# Altium schematic sheet lct_comp.SchDoc: LCT Comparator
size B; Engineer: A. Peck; Organization: UCLA High Energy Physics; DocumentNumber: 2; Revision: 3.0; SheetNumber: 2; SheetTotal: 15; Project: LCT Comparator Tester
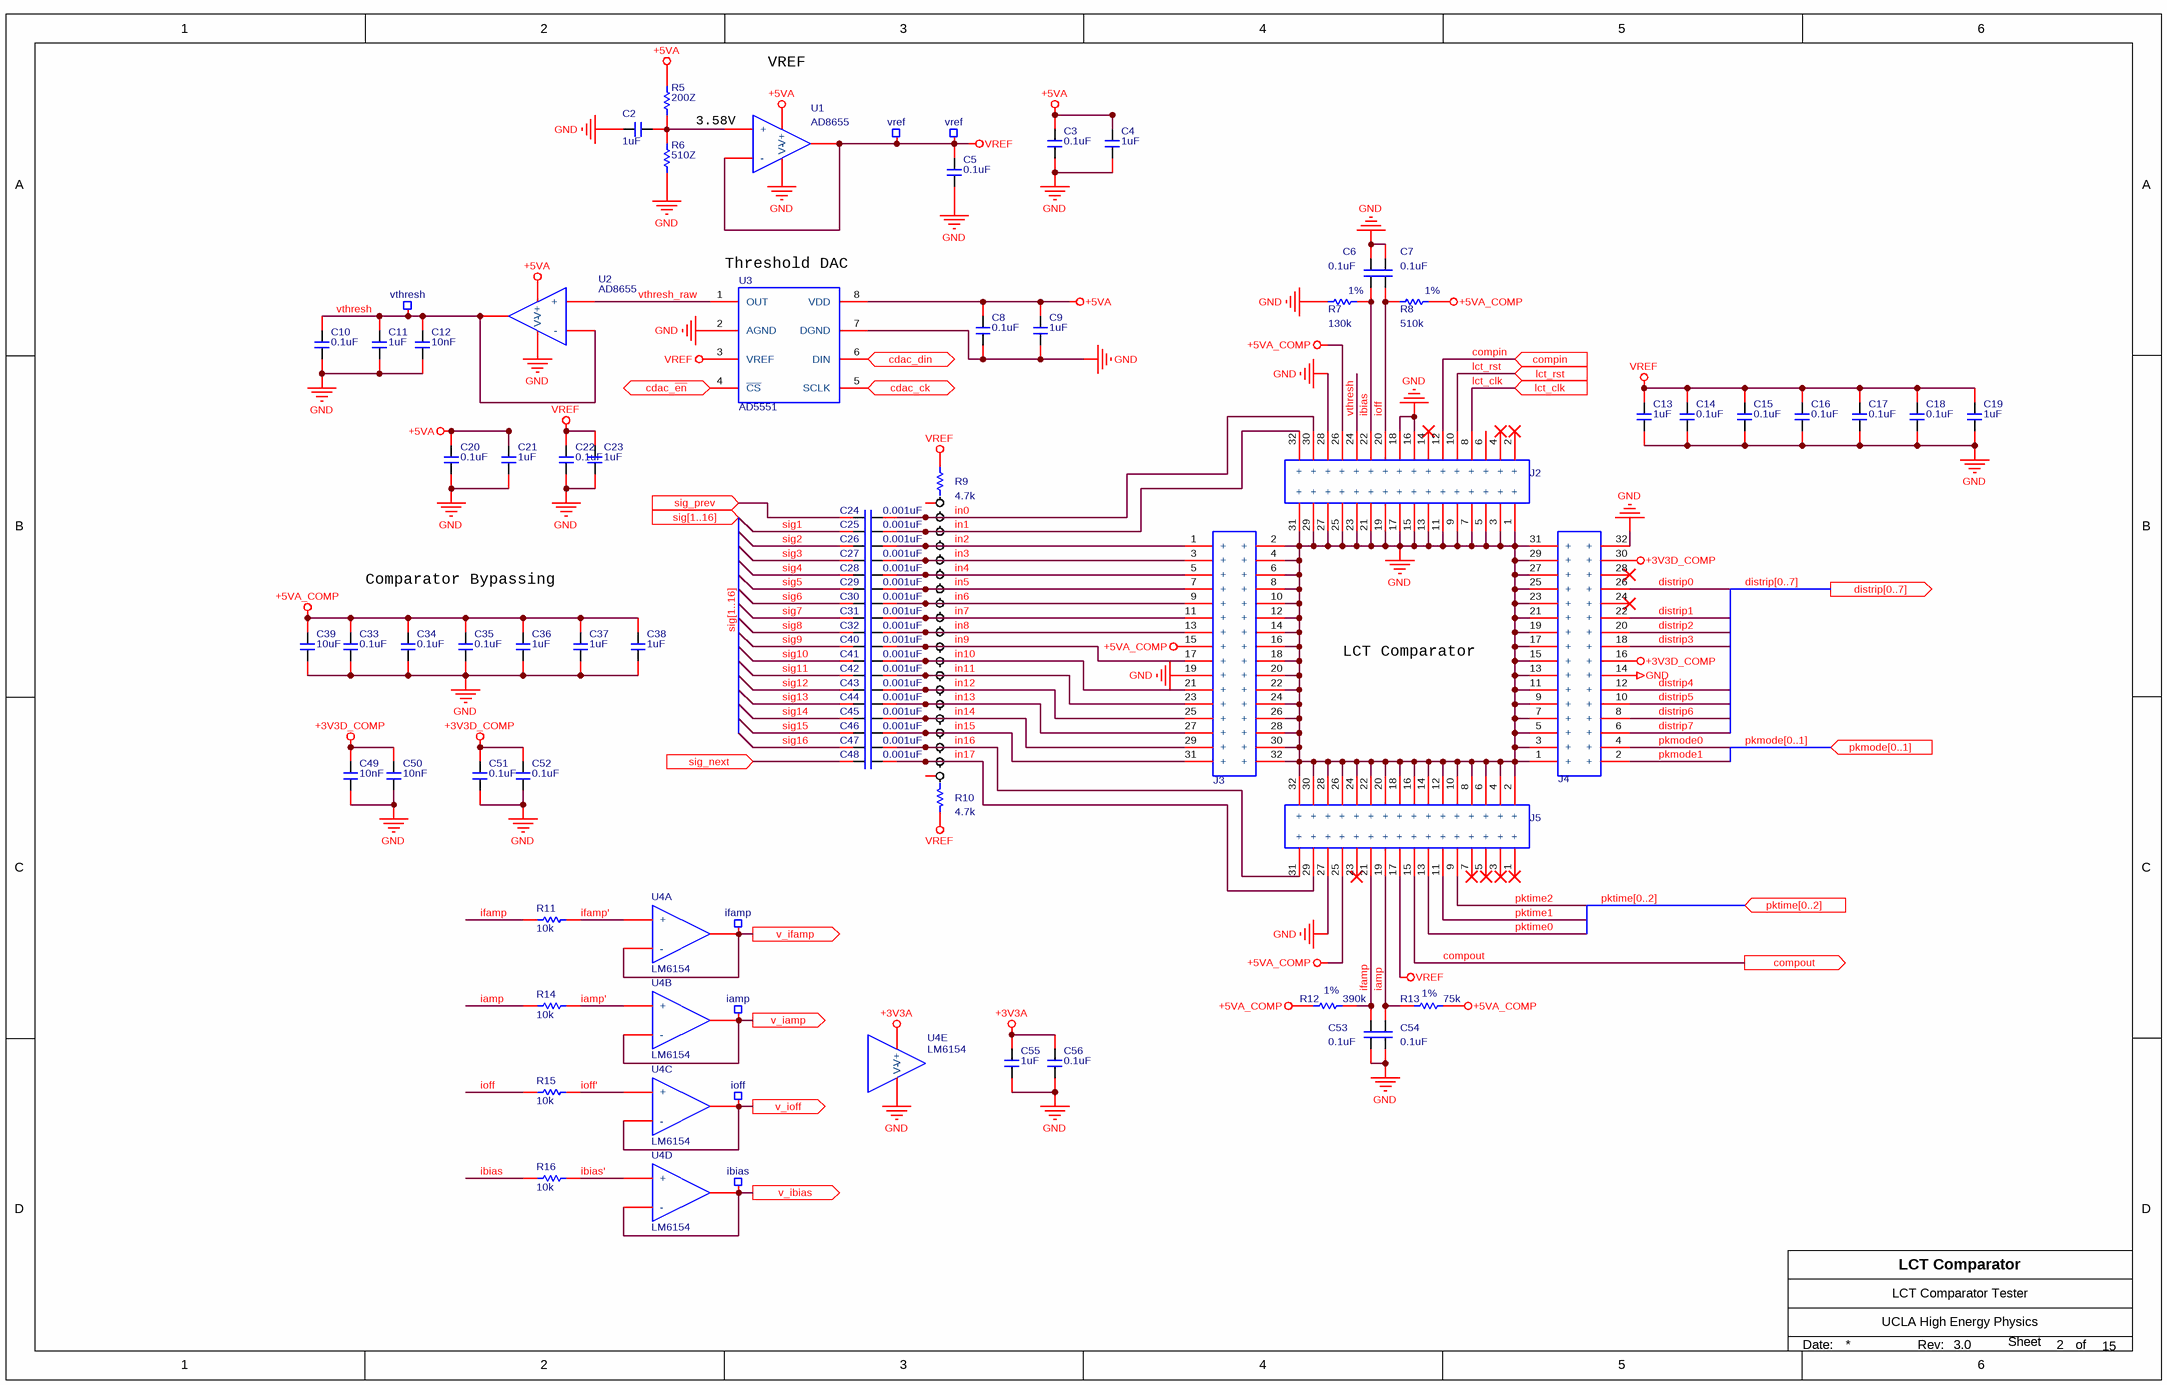
[diagram p0: lct_comp.SchDoc]

## Parts
C2  1uF  [C0603]
C3  0.1uF  [C0603]
C4  1uF  [C0603]
C5  0.1uF  [C0603]
C6  0.1uF  [C0603]
C7  0.1uF  [C0603]
C8  0.1uF  [C0603]
C9  1uF  [C0603]
C10  0.1uF  [C0603]
C11  1uF  [C0603]
C12  10nF  [C0603]
C13  1uF  [C0603]
C14  0.1uF  [C0603]
C15  0.1uF  [C0603]
C16  0.1uF  [C0603]
C17  0.1uF  [C0603]
C18  0.1uF  [C0603]
C19  1uF  [C0603]
C20  0.1uF  [C0603]
C21  1uF  [C0603]
C22  0.1uF  [C0603]
C23  1uF  [C0603]
C24  0.001uF  [C0603]
C25  0.001uF  [C0603]
C26  0.001uF  [C0603]
C27  0.001uF  [C0603]
C28  0.001uF  [C0603]
C29  0.001uF  [C0603]
C30  0.001uF  [C0603]
C31  0.001uF  [C0603]
C32  0.001uF  [C0603]
C33  0.1uF  [C0603]
C34  0.1uF  [C0603]
C35  0.1uF  [C0603]
C36  1uF  [C0603]
C37  1uF  [C0603]
C38  1uF  [C0603]
C39  10uF  [c1206]
C40  0.001uF  [C0603]
C41  0.001uF  [C0603]
C42  0.001uF  [C0603]
C43  0.001uF  [C0603]
C44  0.001uF  [C0603]
C45  0.001uF  [C0603]
C46  0.001uF  [C0603]
C47  0.001uF  [C0603]
C48  0.001uF  [C0603]
C49  10nF  [C0603]
C50  10nF  [C0603]
C51  0.1uF  [C0603]
C52  0.1uF  [C0603]
C53  0.1uF  [C0603]
C54  0.1uF  [C0603]
C55  1uF  [C0603]
C56  0.1uF  [C0603]
J2  HEADER 02x16 RCPT  [HEADER 02x16]  (value not drawn)
J3  HEADER 02x16 RCPT  [HEADER 02x16]  (value not drawn)
J4  HEADER 02x16 RCPT  [HEADER 02x16]  (value not drawn)
J5  HEADER 02x16 RCPT  [HEADER 02x16]  (value not drawn)
R5  200Z  [R0805]
R6  510Z  [R0805]
R7  130k  [R0603]
R8  510k  [R0603]
R9  4.7k  [SIP-11]
R10  4.7k  [SIP-11]
R11  10k  [R0603]
R12  390k  [R0603]
R13  75k  [R0603]
R14  10k  [R0603]
R15  10k  [R0603]
R16  10k  [R0603]
TP1  vref  [TP_MICRO]  (no BOM)
TP2  vref  [TP_MICRO]  (no BOM)
TP3  vthresh  [TP_MICRO]  (no BOM)
TP4  ifamp  [TP_MICRO]  (no BOM)
TP5  iamp  [TP_MICRO]  (no BOM)
TP6  ioff  [TP_MICRO]  (no BOM)
TP7  ibias  [TP_MICRO]  (no BOM)
U1  AD8655  [MSOP-8]
U2  AD8655  [MSOP-8]
U3  AD5551  [SOIC-8]
U4  LM6154  [SOIC-14]  (parts A,B,C,D,E of 5)

## Ports
cdac_ck (in), cdac_din (in), cdac_~{en} (in), compin (in), compout (out), distrip[0..7] (out), lct_clk (in), lct_rst (in), pkmode[0..1] (in), pktime[0..2] (in), sig[1..16] (in), sig_next (in), sig_prev (in), v_iamp (out), v_ibias (out), v_ifamp (out), v_ioff (out)

## Nets
+3V3A: C55.2 C56.2 U4.4(V+)
+3V3D_COMP: C49.2 C50.2 C51.2 C52.2 J4.16(+) J4.30(+)
+5VA: C3.1 C4.2 C8.1 C9.2 C20.1 C21.2 R5.1 U1.7(V+) U2.7(V+) U3.8(VDD)
+5VA_COMP: C33.2 C34.2 C35.2 C36.2 C37.2 C38.2 C39.1 J2.26(+) J3.15(+) J5.25(+) R8.2 R12.1 R13.2
GND: C2.2 C3.2 C4.1 C5.2 C6.2 C7.2 C8.2 C9.1 C10.1 C11.2 C12.1 C13.2 C14.1 C15.1 C16.1 C17.1 C18.1 C19.2 C20.2 C21.1 C22.2 C23.1 C33.1 C34.1 C35.1 C36.1 C37.1 C38.1 C39.2 C49.1 C50.1 C51.1 C52.1 C53.1 C54.1 C55.1 C56.1 J2.1(+) J2.3(+) J2.5(+) J2.7(+) J2.9(+) J2.11(+) J2.13(+) J2.15(+) J2.16(+) J2.17(+) J2.18(+) J2.19(+) J2.21(+) J2.23(+) J2.25(+) J2.27(+) J2.28(+) J2.29(+) J2.31(+) J3.2(+) J3.4(+) J3.6(+) J3.8(+) J3.10(+) J3.12(+) J3.14(+) J3.16(+) J3.18(+) J3.19(+) J3.20(+) J3.22(+) J3.24(+) J3.26(+) J3.28(+) J3.30(+) J3.32(+) J4.1(+) J4.3(+) J4.5(+) J4.7(+) J4.9(+) J4.11(+) J4.13(+) J4.14(+) J4.15(+) J4.17(+) J4.19(+) J4.21(+) J4.23(+) J4.25(+) J4.27(+) J4.29(+) J4.31(+) J4.32(+) J5.2(+) J5.4(+) J5.6(+) J5.8(+) J5.10(+) J5.12(+) J5.14(+) J5.16(+) J5.18(+) J5.20(+) J5.22(+) J5.24(+) J5.26(+) J5.27(+) J5.28(+) J5.30(+) J5.32(+) R6.1 R7.1 U1.4(V-) U2.4(V-) U3.2(AGND) U3.7(DGND) U4.11(V-)
VREF: C5.1 C13.1 C14.2 C15.2 C16.2 C17.2 C18.2 C19.1 C22.1 C23.2 J5.17(+) R9.1 R10.1 TP1.1 TP2.1 U1.2(-) U1.6(OUT) U3.3(VREF)
cdac_ck: U3.5(SCLK) ; port cdac_ck
cdac_din: U3.6(DIN) ; port cdac_din
cdac_~{en}: U3.4(~{CS}) ; port cdac_~{en}
compin: J2.12(+) ; port compin
compout: J5.15(+) ; port compout
distrip0: J4.26(+)
distrip1: J4.22(+)
distrip2: J4.20(+)
distrip3: J4.18(+)
distrip4: J4.12(+)
distrip5: J4.10(+)
distrip6: J4.8(+)
distrip7: J4.6(+)
iamp: C54.2 J5.19(+) R13.1 R14.1
iamp': R14.2 U4.5(+)
ibias: C6.1 J2.22(+) R7.2 R16.1
ibias': R16.2 U4.12(+)
ifamp: C53.2 J5.21(+) R11.1 R12.2
ifamp': R11.2 U4.3(+)
in0: C24.2 J2.30(+) R10.3
in1: C25.2 J2.32(+) R10.4
in2: C26.2 J3.1(+) R10.5
in3: C27.2 J3.3(+) R10.6
in4: C28.2 J3.5(+) R10.7
in5: C29.2 J3.7(+) R10.8
in6: C30.2 J3.9(+) R10.9
in7: C31.2 J3.11(+) R10.10
in8: C32.2 J3.13(+) R10.11
in9: C40.2 J3.17(+) R9.11
in10: C41.2 J3.21(+) R9.10
in11: C42.2 J3.23(+) R9.9
in12: C43.2 J3.25(+) R9.8
in13: C44.2 J3.27(+) R9.7
in14: C45.2 J3.29(+) R9.6
in15: C46.2 J3.31(+) R9.5
in16: C47.2 J5.31(+) R9.4
in17: C48.2 J5.29(+) R9.3
ioff: C7.1 J2.20(+) R8.1 R15.1
ioff': R15.2 U4.10(+)
lct_clk: J2.8(+) ; port lct_clk
lct_rst: J2.10(+) ; port lct_rst
pkmode0: J4.4(+)
pkmode1: J4.2(+)
pktime0: J5.13(+)
pktime1: J5.11(+)
pktime2: J5.9(+)
sig1: C25.1 ; port sig[1..16]
sig2: C26.1
sig3: C27.1
sig4: C28.1
sig5: C29.1
sig6: C30.1
sig7: C31.1
sig8: C32.1
sig9: C40.1  [also labelled sig[1..16]]
sig10: C41.1
sig11: C42.1
sig12: C43.1
sig13: C44.1
sig14: C45.1
sig15: C46.1
sig16: C47.1
sig_next: C48.1 ; port sig_next
sig_prev: C24.1 ; port sig_prev
v_iamp: TP5.1 U4.6(-) U4.7(OUT) ; port v_iamp
v_ibias: TP7.1 U4.13(-) U4.14(OUT) ; port v_ibias
v_ifamp: TP4.1 U4.1(OUT) U4.2(-) ; port v_ifamp
v_ioff: TP6.1 U4.8(OUT) U4.9(-) ; port v_ioff
vthresh: C10.2 C11.1 C12.2 J2.24(+) TP3.1 U2.2(-) U2.6(OUT)
vthresh_raw: U2.3(+) U3.1(OUT)
NetC2_1: C2.1 R5.2 R6.2 U1.3(+)

Not connected (* = marked no-connect by the designer): J2 2(+)* 4(+)* 6(+) 14(+)*; J4 24(+)* 28(+)*; J5 1(+)* 3(+)* 5(+)* 7(+)* 23(+)*; R9 2; R10 2; U1 5(NC) NC(8); U2 5(NC) NC(8)

## Buses and harness runs
bus distrip[0..7] = port distrip[0..7]
bus pkmode[0..1] = port pkmode[0..1]
bus pktime[0..2] = port pktime[0..2]

## Notes on the sheet
- VREF
- 3.58V
- (near U3) Threshold DAC
- (near R7) 1%
- (near R8) 1%
- Comparator Bypassing
- LCT Comparator
- (near R12) 1%
- (near R13) 1%
- Date:
- Rev:
- of
- Sheet

## Library data of the parts
C2 C4 C9 C11 C13 C19 C21 C23 C36-C38 C55 = Murata/GRM188R61E105KA12D: CAP-CER, 2, 1.0uF, 10%, 25V, 0603; Manufacturer: Murata Electronics North America; Capacitance: 1µF; Temperature Coefficient: X5R; Supplier 1: Digi-Key; Supplier Part Number 1: 490-3897-1-ND; Manufacturer Part Number: GRM188R61E105KA12D; RoHS: RoHS Compliant; Category: Capacitors; Stock 1: 1899119; Pricing 1: 1=0.1, 10=0.036, 50=0.0196, 100=0.0165, 250=0.01352, 500=0.01156, 1000=0.009 (USD); Packaging: Cut Tape (CT); Tolerance: ±10%; Voltage - Rated: 25V; Mounting Type: Surface Mount, MLCC; Operating Temperature: -55°C ~ 85°C; Applications: General Purpose; Ratings: -; Package / Case: 0603 (1608 Metric); Size / Dimension: 0.063" L x 0.031" W (1.60mm x 0.80mm); Height - Seated (Max): -; Thickness (Max): 0.035" (0.90mm); Lead Spacing: -; Features: -; Lead Style: -; ComponentLink1URL: http://www.murata.com/~/media/webrenewal/support/library/catalog/products/capacitor/mlcc/c02e.pdf; ComponentLink1Description: http://www.murata.com/~/media/webrenewal/support/library/catalog/products/capacitor/mlcc/c02e.pdf
C3 C5-C8 C10 C14-C18 C20 C22 C33-C35 C51-C54 C56 = CAP/06035C104KAT2A: CAP-CER, 2, 0.1uF, 10%, 50V, 0603, X7R; Manufacturer: AVX Corporation; Capacitance: 0.10µF; Supplier 1: Digi-Key; Manufacturer Part Number: 06035C104KAT2A; RoHS: RoHS Compliant; Category: Capacitors; Stock 1: 4412408; Pricing 1: 1=0.1, 10=0.036, 25=0.0264, 50=0.0198, 100=0.0162, 250=0.01352, 500=0.01156, 1000=0.00908 (USD); Packaging: Cut Tape (CT); Tolerance: ±10%; Voltage - Rated: 50V; Temperature Coefficient: X7R; Mounting Type: Surface Mount, MLCC; Operating Temperature: -55°C ~ 125°C; Applications: General Purpose; Ratings: -; Package / Case: 0603 (1608 Metric); Size / Dimension: 0.063" L x 0.032" W (1.60mm x 0.81mm); Height - Seated (Max): -; Thickness (Max): 0.035" (0.90mm); Lead Spacing: -; Features: -; Lead Style: -; ComponentLink1URL: http://datasheets.avx.com/X7RDielectric.pdf; ComponentLink1Description: http://datasheets.avx.com/X7RDielectric.pdf; Supplier Part Number 1: 478-5052-1-ND; Supplier 2: Newark; Supplier Part Number 2: 54K2412
C12 C49 C50 = CAP/GRM188R71H103KA01D: CAP-CER, 2, 0.01uF, 10%, 50V, X7R, 0603; Manufacturer: Murata Electronics North America; Capacitance: 10000pF; Supplier 1: Digi-Key; Supplier Part Number 1: 490-1512-1-ND; Manufacturer Part Number: GRM188R71H103KA01D; RoHS: RoHS Compliant; Category: Capacitors; Stock 1: 3035311; Pricing 1: 1=0.1, 10=0.019, 50=0.01, 100=0.0085, 250=0.00696, 500=0.00596, 1000=0.00465 (USD); Packaging: Cut Tape (CT); Tolerance: ±10%; Voltage - Rated: 50V; Temperature Coefficient: X7R; Mounting Type: Surface Mount, MLCC; Operating Temperature: -55°C ~ 125°C; Applications: General Purpose; Ratings: -; Package / Case: 0603 (1608 Metric); Size / Dimension: 0.063" L x 0.031" W (1.60mm x 0.80mm); Height - Seated (Max): -; Thickness (Max): 0.035" (0.90mm); Lead Spacing: -; Features: -; Lead Style: -; ComponentLink1URL: http://www.murata.com/~/media/webrenewal/support/library/catalog/products/capacitor/mlcc/c02e.pdf; ComponentLink1Description: http://www.murata.com/~/media/webrenewal/support/library/catalog/products/capacitor/mlcc/c02e.pdf; Supplier 2: Newark; Supplier Part Number 2: 38K1669
C24-C32 C40-C48 = CAP/GRM188R71H102KA01D: CAP-CER, 0, 1000pF, 10%, 50V, 0603; Manufacturer: Murata Electronics North America; Temperature Coefficient: X7R; Supplier 1: Digi-Key; Supplier Part Number 1: 490-1494-6-ND; Manufacturer Part Number: GRM188R71H102KA01D; RoHS: RoHS Compliant; Category: Capacitors; Stock 1: 1044569; Pricing 1: 1=0.1, 10=0.02, 50=0.0108, 100=0.0091, 250=0.00744, 500=0.00636, 1000=0.00495 (USD); Packaging: Digi-Reel®; Capacitance: 1000pF; Tolerance: ±10%; Voltage - Rated: 50V; Mounting Type: Surface Mount, MLCC; Operating Temperature: -55°C ~ 125°C; Applications: General Purpose; Ratings: -; Package / Case: 0603 (1608 Metric); Size / Dimension: 0.063" L x 0.031" W (1.60mm x 0.80mm); Height - Seated (Max): -; Thickness (Max): 0.035" (0.90mm); Lead Spacing: -; Features: -; Lead Style: -; ComponentLink1URL: http://www.murata.com/~/media/webrenewal/support/library/catalog/products/capacitor/mlcc/c02e.pdf; ComponentLink1Description: http://www.murata.com/~/media/webrenewal/support/library/catalog/products/capacitor/mlcc/c02e.pdf; Supplier 2: Newark; Supplier Part Number 2: 51B220
C39 = CAP/GMK316F106ZL-T: CAP-CER, 2, 10uF, 10%, 35V, 1206; Manufacturer: Taiyo Yuden; Capacitance: 10µF; Tolerance: -20%, +80%; Temperature Coefficient: Y5V (F); Supplier 1: Digi-Key; Manufacturer Part Number: GMK316F106ZL-T; RoHS: RoHS Compliant; Category: Capacitors; Packaging: Cut Tape (CT); Voltage - Rated: 35V; Mounting Type: Surface Mount, MLCC; Operating Temperature: -30°C ~ 85°C; Package / Case: 1206 (3216 Metric); Size / Dimension: 0.126" L x 0.063" W (3.20mm x 1.60mm); Height - Seated (Max): -; Lead Spacing: -; Features: -; ComponentLink1URL: http://ds.yuden.co.jp/TYCOMPAS/ut/detail.do?productNo=GMK316F106ZL-T&fileName=GMK316F106ZL-T_SS&mode=specSheetDownload; ComponentLink1Description: http://ds.yuden.co.jp/TYCOMPAS/ut/detail.do?productNo=GMK316F106ZL-T&fileName=GMK316F106ZL-T_SS&mode=specSheetDownload; Supplier Part Number 1: 587-1352-1-ND; Stock 1: 249989; Pricing 1: 1=0.46, 10=0.345, 50=0.2012, 100=0.161, 250=0.115, 500=0.0782, 1000=0.06325 (USD); Applications: General Purpose; Ratings: -; Thickness (Max): 0.071" (1.80mm); Lead Style: -
J2-J5 = HEADER 02x16 RCPT: Header, 02x16, 100 mil, PTH; Manufacturer: TE Connectivity AMP Connectors; Manufacturer Part Number: 6-534206-6; Connector Type: Receptacle; Number of Positions: 32; Number of Positions Loaded: All; Pitch: 0.100" (2.54mm); Supplier 1: Digi-Key; RoHS: RoHS Compliant; Category: Connectors, Interconnects; Stock 1: 447; Pricing 1: 1=4.43, 10=4.255, 50=3.7234, 100=3.546, 250=3.10276, 500=3.0141, 1000=2.57085, 2500=2.561 (USD); Packaging: Tube; Part Status: Active; Contact Type: Female Socket; Number of Rows: 2; Row Spacing: 0.100" (2.54mm); Mounting Type: Through Hole; Termination: Solder; Fastening Type: -; Features: -; Contact Finish: Gold; Contact Finish Thickness: 30µin (0.76µm); Color: Black; ComponentLink1URL: http://www.te.com/commerce/DocumentDelivery/DDEController?Action=srchrtrv&DocNm=534206&DocType=Customer+Drawing&DocLang=English; ComponentLink1Description: http://www.te.com/commerce/DocumentDelivery/DDEController?Action=srchrtrv&DocNm=534206&DocType=Customer+Drawing&DocLang=English; Supplier Part Number 1: A32946-ND
R5 = CRCW0805200RFKEA: RES0, SMD,  200Z, 1.0%, 1/10W, 0805; Manufacturer: Vishay Dale; Resistance (Ohms): 200; Tolerance: ±1%; Power (Watts): 0.125W, 1/8W; Temperature Coefficient: ±100ppm/°C; Supplier 1: Digi-Key; Manufacturer Part Number: CRCW0805200RFKEA; RoHS: RoHS Compliant; Category: Resistors; Stock 1: 204736; Pricing 1: 1=0.1, 10=0.04, 25=0.0288, 50=0.022, 100=0.0162, 250=0.01236, 500=0.0099, 1000=0.00729, 2500=0.00632 (USD); Packaging: Cut Tape (CT); Part Status: Active; Composition: Thick Film; Features: Automotive AEC-Q200; Operating Temperature: -55°C ~ 155°C; Package / Case: 0805 (2012 Metric); Supplier Device Package: 0805; Size / Dimension: 0.079" L x 0.049" W (2.00mm x 1.25mm); Height - Seated (Max): 0.020" (0.50mm); Number of Terminations: 2; Failure Rate: -; ComponentLink1URL: http://www.vishay.com/docs/20035/dcrcwe3.pdf; ComponentLink1Description: http://www.vishay.com/docs/20035/dcrcwe3.pdf; Supplier Part Number 1: 541-200CCT-ND
R6 = CRCW0805510RFKEA: RES0, SMD,  510Z, 1.0%, 1/10W, 0805; Manufacturer: Vishay Dale; Resistance (Ohms): 510; Tolerance: ±1%; Power (Watts): 0.125W, 1/8W; Temperature Coefficient: ±100ppm/°C; Supplier 1: Digi-Key; Manufacturer Part Number: CRCW0805510RFKEA; RoHS: RoHS Compliant; Category: Resistors; Stock 1: 33353; Pricing 1: 1=0.1, 10=0.04, 25=0.0288, 50=0.022, 100=0.0162, 250=0.01236, 500=0.0099, 1000=0.00729, 2500=0.00632 (USD); Packaging: Cut Tape (CT); Part Status: Active; Composition: Thick Film; Features: Automotive AEC-Q200; Operating Temperature: -55°C ~ 155°C; Package / Case: 0805 (2012 Metric); Supplier Device Package: 0805; Size / Dimension: 0.079" L x 0.049" W (2.00mm x 1.25mm); Height - Seated (Max): 0.020" (0.50mm); Number of Terminations: 2; Failure Rate: -; ComponentLink1URL: http://www.vishay.com/docs/20035/dcrcwe3.pdf; ComponentLink1Description: http://www.vishay.com/docs/20035/dcrcwe3.pdf; Supplier Part Number 1: 541-510CCT-ND
R7 = CRCW0603130KFKEA: RES1, SMD,  130k, 1.0%, 1/10W, 0603; Manufacturer: Vishay Dale; Tolerance: ±1%; Power (Watts): 0.1W, 1/10W; Temperature Coefficient: ±100ppm/°C; Supplier 1: Digi-Key; Manufacturer Part Number: CRCW0603130KFKEA; RoHS: RoHS Compliant; Category: Resistors; Stock 1: 32167; Pricing 1: 1=0.1, 10=0.03, 25=0.022, 50=0.0168, 100=0.0123, 250=0.0094, 500=0.00752, 1000=0.00554, 2500=0.00481 (USD); Packaging: Cut Tape (CT); Part Status: Active; Resistance (Ohms): 130k; Composition: Thick Film; Features: Automotive AEC-Q200; Operating Temperature: -55°C ~ 155°C; Package / Case: 0603 (1608 Metric); Supplier Device Package: 0603; Size / Dimension: 0.063" L x 0.033" W (1.60mm x 0.85mm); Height - Seated (Max): 0.020" (0.50mm); Number of Terminations: 2; Failure Rate: -; ComponentLink1URL: http://www.vishay.com/docs/20035/dcrcwe3.pdf; ComponentLink1Description: http://www.vishay.com/docs/20035/dcrcwe3.pdf; Supplier Part Number 1: 541-130KHCT-ND
R8 = RES/RC0603JR-07510KL: RES1, SMD,  510k, 1.0%, 1/10W, 0603; Manufacturer: Yageo; Tolerance: ±5%; Power (Watts): 0.1W, 1/10W; Temperature Coefficient: ±100ppm/°C; Supplier 1: Digi-Key; Manufacturer Part Number: RC0603JR-07510KL; RoHS: RoHS Compliant; Category: Resistors; Stock 1: 110895; Pricing 1: 1=0.1, 10=0.011, 25=0.008, 100=0.0044, 250=0.00336, 500=0.0027, 1000=0.00198, 2500=0.00172 (USD); Packaging: Cut Tape (CT); Resistance (Ohms): 510k; Composition: Thick Film; Features: Moisture Resistant; Operating Temperature: -55°C ~ 155°C; Package / Case: 0603 (1608 Metric); Supplier Device Package: 0603; Size / Dimension: 0.063" L x 0.031" W (1.60mm x 0.80mm); Height: 0.022" (0.55mm); Number of Terminations: 2; ComponentLink1URL: http://www.yageo.com/documents/recent/PYu-RC_Group_51_RoHS_L_04.pdf; ComponentLink1Description: http://www.yageo.com/documents/recent/PYu-RC_Group_51_RoHS_L_04.pdf; Supplier Part Number 1: 311-510KGRCT-ND
R9 R10 = R4K7_SIP10: 4611X-101-472LF; Manufacturer: Bourns Inc.; Circuit Type: Bussed; Tolerance: ±2%; Number of Resistors: 10; Power Per Element: 200mW; Temperature Coefficient: ±100ppm/°C; Manufacturer Part Number: 4611X-101-472LF; RoHS: RoHS Compliant; Category: Resistors; Packaging: Bulk; Resistance (Ohms): 4.7k; Number of Pins: 11; Operating Temperature: -55°C ~ 125°C; Applications: -; Mounting Type: Through Hole; Package / Case: 11-SIP; Supplier Device Package: 11-SIP; Size / Dimension: 1.098" L x 0.098" W (27.89mm x 2.49mm); Height: 0.200" (5.08mm); ComponentLink1URL: http://www.bourns.com/data/global/pdfs/4600x.pdf; ComponentLink1Description: http://www.bourns.com/data/global/pdfs/4600x.pdf; Supplier 1: Digi-Key; Stock 1: 279; Pricing 1: 1=0.45, 10=0.416, 25=0.3752, 50=0.3626, 100=0.35, 250=0.325, 500=0.3, 1000=0.28125, 2500=0.2375 (USD); Supplier Part Number 1: 4611X-101-472LF-ND
R11 R14-R16 = CRCW060310K0FKEA: RES1, SMD, 10.0k, 1.0%, 1/10W, 0603; Manufacturer: Vishay Dale; Tolerance: ±1%; Power (Watts): 0.1W, 1/10W; Temperature Coefficient: ±100ppm/°C; Supplier 1: Digi-Key; Manufacturer Part Number: CRCW060310K0FKEA; RoHS: RoHS Compliant; Category: Resistors; Stock 1: 1592879; Pricing 1: 1=0.1, 10=0.03, 25=0.022, 50=0.0168, 100=0.0123, 250=0.0094, 500=0.00752, 1000=0.00554, 2500=0.00481 (USD); Packaging: Cut Tape (CT); Resistance (Ohms): 10k; Composition: Thick Film; Features: Automotive AEC-Q200; Operating Temperature: -55°C ~ 155°C; Package / Case: 0603 (1608 Metric); Supplier Device Package: 0603; Size / Dimension: 0.061" L x 0.033" W (1.55mm x 0.85mm); Height: 0.020" (0.50mm); Number of Terminations: 2; ComponentLink1URL: http://www.vishay.com/docs/20035/dcrcwe3.pdf; ComponentLink1Description: http://www.vishay.com/docs/20035/dcrcwe3.pdf; Supplier Part Number 1: 541-10.0KHCT-ND
R12 = CRCW0603390KFKEA: RES1, SMD,  390k, 1.0%, 1/10W, 0603; Manufacturer: Vishay Dale; Tolerance: ±1%; Power (Watts): 0.1W, 1/10W; Temperature Coefficient: ±100ppm/°C; Supplier 1: Digi-Key; Manufacturer Part Number: CRCW0603390KFKEA; RoHS: RoHS Compliant; Category: Resistors; Stock 1: 37100; Pricing 1: 1=0.1, 10=0.03, 25=0.022, 50=0.0168, 100=0.0123, 250=0.0094, 500=0.00752, 1000=0.00554, 2500=0.00481 (USD); Packaging: Cut Tape (CT); Part Status: Active; Resistance (Ohms): 390k; Composition: Thick Film; Features: Automotive AEC-Q200; Operating Temperature: -55°C ~ 155°C; Package / Case: 0603 (1608 Metric); Supplier Device Package: 0603; Size / Dimension: 0.063" L x 0.033" W (1.60mm x 0.85mm); Height - Seated (Max): 0.020" (0.50mm); Number of Terminations: 2; Failure Rate: -; ComponentLink1URL: http://www.vishay.com/docs/20035/dcrcwe3.pdf; ComponentLink1Description: http://www.vishay.com/docs/20035/dcrcwe3.pdf; Supplier Part Number 1: 541-390KHCT-ND
R13 = CRCW060375K0FKEA: RES1, SMD, 75.0k, 1.0%, 1/10W, 0603; Manufacturer: Samsung Electro-Mechanics America, Inc; Manufacturer Part Number: RC1608F4751CS; Resistance (Ohms): 4.75k; Tolerance: ±1%; Power (Watts): 0.1W, 1/10W; Temperature Coefficient: ±100ppm/°C; Supplier 1: Digi-Key; RoHS: RoHS Compliant; Category: Resistors; Stock 1: 15535; Pricing 1: 1=0.1, 10=0.011, 25=0.0084, 100=0.0047, 500=0.00286, 1000=0.0021, 2500=0.00182 (USD); Packaging: Cut Tape (CT); Composition: Thick Film; Features: -; Operating Temperature: -55°C ~ 155°C; Package / Case: 0603 (1608 Metric); Supplier Device Package: 0603 (1608 Metric); Size / Dimension: 0.063" L x 0.031" W (1.60mm x 0.80mm); Height: 0.022" (0.55mm); Number of Terminations: 2; ComponentLink1URL: http://www.samsungsem.com/global/support/library/product-catalog/__icsFiles/afieldfile/2015/01/12/CHIP_RESISTOR_150112_1.pdf; ComponentLink1Description: http://www.samsungsem.com/global/support/library/product-catalog/__icsFiles/afieldfile/2015/01/12/CHIP_RESISTOR_150112_1.pdf; Supplier Part Number 1: 1276-4710-1-ND
TP1-TP7 = TP_MICRO: Test Point, Round, Small
U1 U2 = AD/AD8655 MSOP-8: OPA, 28MHz, 11V/ us; Manufacturer: ANALOG DEVICES; Manufacturer Part Number: AD8655ARMZ; Amplifier Type: General Purpose; Number of Circuits: 1; Output Type: Rail-to-Rail; Slew Rate: 11 V/µs; Current - Input Bias: 1pA; Voltage - Input Offset: 50µV; Current - Supply: 3.7mA; Current - Output / Channel: 220mA; Voltage - Supply, Single/Dual (±): 2.7 V ~ 5.5 V; RoHS: YES; ComponentLink1URL: http://www.farnell.com/cad/1659554.zip; ComponentLink1Description: http://www.farnell.com/cad/1659554.zip; ComponentLink2URL: http://www.farnell.com/simulation/1738389.zip; ComponentLink2Description: http://www.farnell.com/simulation/1738389.zip; ComponentLink3URL: http://www.farnell.com/datasheets/1790136.pdf; ComponentLink3Description: http://www.farnell.com/datasheets/1790136.pdf; Category: Integrated Circuits (ICs); Packaging: Cut Tape (CT); Gain Bandwidth Product: 28MHz; -3db Bandwidth: -; Operating Temperature: -40°C ~ 125°C; Mounting Type: Surface Mount; Package / Case: 8-SOIC (0.154", 3.90mm Width); Supplier Device Package: 8-SOIC; ComponentLink4URL: http://www.analog.com/static/imported-files/data_sheets/AD8655_8656.pdf; ComponentLink4Description: http://www.analog.com/static/imported-files/data_sheets/AD8655_8656.pdf; Supplier 1: Digi-Key; Stock 1: 7774; Pricing 1: 1=2.28, 10=2.05, 100=1.6441, 500=1.35136, 1000=1.11862 (USD); Part Status: Active; ComponentLink5URL: http://www.analog.com/media/en/technical-documentation/data-sheets/AD8655_8656.pdf; ComponentLink5Description: http://www.analog.com/media/en/technical-documentation/data-sheets/AD8655_8656.pdf; Supplier Part Number 1: AD8655ARMZ-REELCT-ND
U3 = AD/AD5551 SOIC-8: DAC, 14-BIT, 1MSPS; Manufacturer: Analog Devices Inc.; Manufacturer Part Number: AD5551BRZ; Number of Bits: 14; Number of D/A Converters: 1; Settling Time: 1µs (Typ); Output Type: Voltage - Unbuffered; Differential Output: No; Data Interface: SPI; Reference Type: External; Voltage - Supply, Analog: 2.7 V ~ 5.5 V; INL/DNL (LSB): ±0.15, ±0.15; Architecture: R-2R; Supplier 1: Digi-Key; RoHS: RoHS Compliant; Category: Integrated Circuits (ICs); Packaging: Tube; Part Status: Active; Voltage - Supply, Digital: 2.7 V ~ 5.5 V; Operating Temperature: -40°C ~ 85°C; Package / Case: 8-SOIC (0.154", 3.90mm Width); Supplier Device Package: 8-SOIC; ComponentLink1URL: http://www.analog.com/media/en/technical-documentation/data-sheets/AD5551_5552.pdf; ComponentLink1Description: http://www.analog.com/media/en/technical-documentation/data-sheets/AD5551_5552.pdf; Stock 1: 625; Pricing 1: 1=16.85, 10=15.487, 100=13.0795, 500=11.63516, 1000=10.67225, 2500=10.27104, 5000=9.95007 (USD); Supplier Part Number 1: AD5551BRZ-ND
U4 = TI/LM6154 SOIC-14: OPA, 75MHz, Quad, RRIO; Manufacturer: Texas Instruments; Manufacturer Part Number: LM6154BCM/NOPB; Amplifier Type: General Purpose; Number of Circuits: 4; Output Type: Rail-to-Rail; Slew Rate: 30 V/µs; Gain Bandwidth Product: 80MHz; Current - Input Bias: 500nA; Voltage - Input Offset: 300µV; Current - Supply: 1.6mA; Current - Output / Channel: 16.9mA; Voltage - Supply, Single/Dual (±): 2.7 V ~ 24 V, ±1.35 V ~ 12 V; Supplier 1: Digi-Key; RoHS: RoHS Compliant; Category: Integrated Circuits (ICs); Stock 1: 869; Pricing 1: 1=7.18, 10=6.458, 50=5.8836, 100=5.3095, 250=4.879, 500=4.4485, 750=4.10411, 1000=3.8745 (USD); Packaging: Tube; -3db Bandwidth: -; Operating Temperature: 0°C ~ 70°C; Mounting Type: Surface Mount; Package / Case: 14-SOIC (0.154", 3.90mm Width); Supplier Device Package: 14-SOICN; ComponentLink1URL: http://www.ti.com/lit/ds/symlink/lm6152.pdf; ComponentLink1Description: http://www.ti.com/lit/ds/symlink/lm6152.pdf; Supplier Part Number 1: LM6154BCM/NOPB-ND